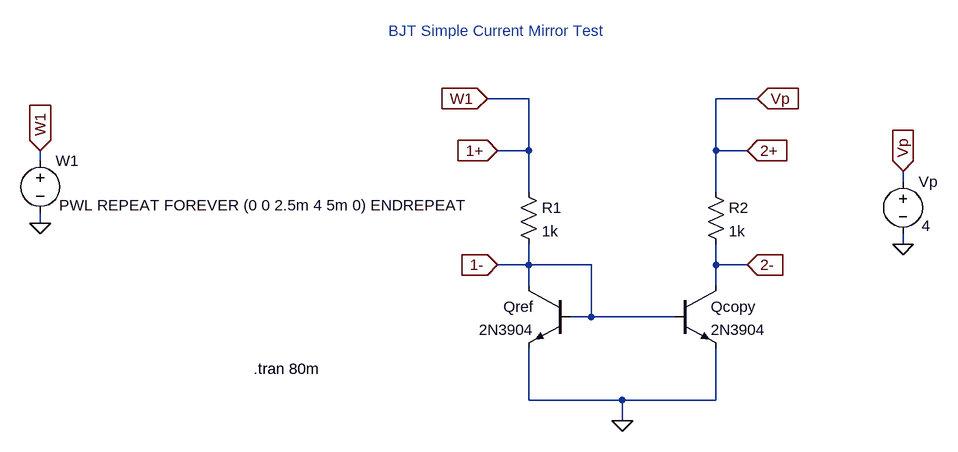
[diagram p0: schematic bjt_mirror.asc]
bjt_mirror.asc, the LTspice schematic file:
Version 4
SHEET 1 2016 1044
WIRE -208 -96 -272 -96
WIRE 144 -96 80 -96
WIRE -208 -16 -208 -96
WIRE -208 -16 -256 -16
WIRE 80 -16 80 -96
WIRE 128 -16 80 -16
WIRE -960 0 -960 -16
WIRE 368 32 368 16
WIRE -208 48 -208 -16
WIRE 80 48 80 -16
WIRE -960 96 -960 80
WIRE 368 128 368 112
WIRE -208 160 -208 128
WIRE -208 160 -256 160
WIRE -112 160 -208 160
WIRE 80 160 80 128
WIRE 128 160 80 160
WIRE -208 192 -208 160
WIRE 80 192 80 160
WIRE -112 240 -112 160
WIRE -112 240 -144 240
WIRE 16 240 -112 240
WIRE -208 368 -208 288
WIRE -64 368 -208 368
WIRE 80 368 80 288
WIRE 80 368 -64 368
WIRE -64 400 -64 368
FLAG -960 96 0
FLAG -960 -16 W1
IOPIN -960 -16 In
FLAG -64 400 0
FLAG -272 -96 W1
IOPIN -272 -96 In
FLAG 144 -96 Vp
IOPIN 144 -96 In
FLAG -256 -16 1+
IOPIN -256 -16 In
FLAG -256 160 1-
IOPIN -256 160 In
FLAG 128 -16 2+
IOPIN 128 -16 In
FLAG 128 160 2-
IOPIN 128 160 In
FLAG 368 128 0
FLAG 368 16 Vp
IOPIN 368 16 In
SYMBOL voltage -960 -16 R0
WINDOW 3 29 84 Left 2
WINDOW 123 0 0 Left 0
WINDOW 39 0 0 Left 0
SYMATTR Value PWL REPEAT FOREVER (0 0 2.5m 4 5m 0) ENDREPEAT
SYMATTR InstName W1
SYMBOL res -224 32 R0
SYMATTR InstName R1
SYMATTR Value 1k
SYMBOL res 64 32 R0
SYMATTR InstName R2
SYMATTR Value 1k
SYMBOL npn -144 192 M0
SYMATTR InstName Qref
SYMATTR Value 2N3904
SYMBOL npn 16 192 R0
SYMATTR InstName Qcopy
SYMATTR Value 2N3904
SYMBOL voltage 368 16 R0
WINDOW 3 29 84 Left 2
WINDOW 123 0 0 Left 0
WINDOW 39 0 0 Left 0
SYMATTR Value 4
SYMATTR InstName Vp
TEXT -424 -200 Left 2 ;BJT Simple Current Mirror Test
TEXT -632 320 Left 2 !.tran 80m

The netlist it stands for:
* bjt_mirror.asc
V§W1 1+ 0 PWL REPEAT FOREVER (0 0 2.5m 4 5m 0) ENDREPEAT
R1 1+ 1- 1k
R2 2+ 2- 1k
Qref 1- 1- 0 0 2N3904
Qcopy 2- 1- 0 0 2N3904
Vp 2+ 0 4
.model NPN NPN
.model PNP PNP
.lib standard.bjt
* BJT Simple Current Mirror Test
.tran 80m
.backanno
.end